# Altium schematic sheet EDP_Scematic.SchDoc
size A; SheetNumber: 1; SheetTotal: 1
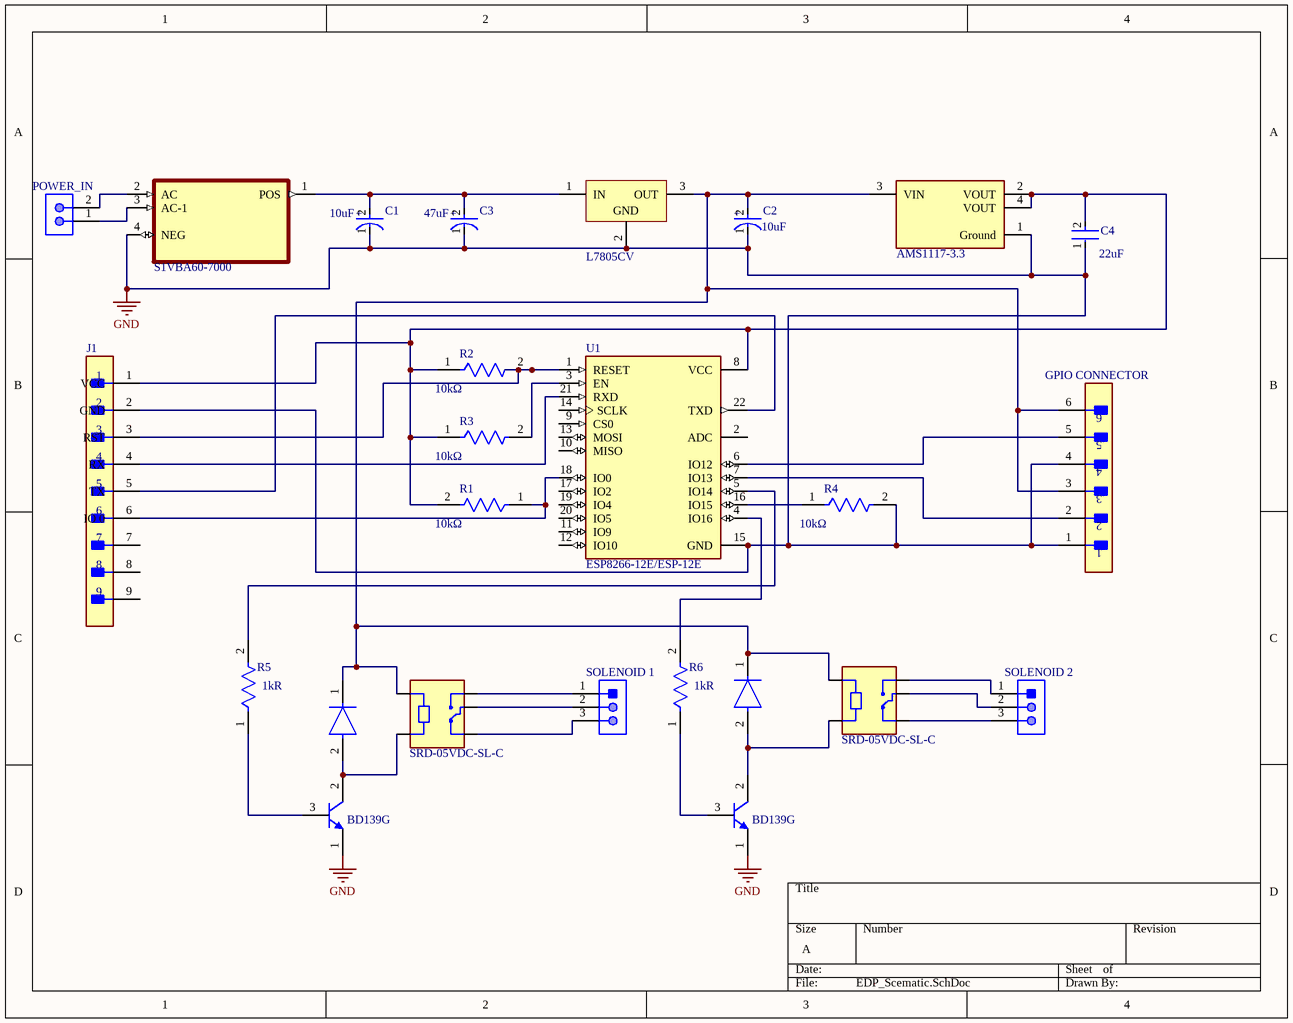
[diagram p0: EDP_Scematic.SchDoc]

## Parts
C1  Capacitance: 10uF  [FP-ECE-A1HN100U-MFG]  (hidden comment: ECE-A1HN100U)
C2  Capacitance: 10uF  [FP-ECE-A1HN100U-MFG]  (hidden comment: ECE-A1HN100U)
C3  Capacitance: 47uF  [FP-RAD-TH-D_6_3_0_5-L_11-MFG]  (hidden comment: EEUFR1H470)
C4  Capacitance: 22uF  [FP-RAD-TH-D_8_0_5-L_11_5-MFG]  (hidden comment: ECA1HEN220)
D1  1N4007-E3/54  [FP-1N4007-MFG]  (value not drawn)
D2  1N4007-E3/54  [FP-1N4007-MFG]  (value not drawn)
GPIO_CONNECTOR  22-27-2061  [FP-22-27-2061-MFG]  (value not drawn)
J1  GRPB091VWCN-RC  [FP-GRPB091VWCN-RC-MFG]  (value not drawn)
K1  SRD-05VDC-SL-C  [RELAY_SRD-05VDC-SL-C]
K2  SRD-05VDC-SL-C  [RELAY_SRD-05VDC-SL-C]
POWER_IN  22-27-2021  [MOLX-22-27-2021_V]  (value not drawn)
Q1  BD139G  [ONSC-TO-225-3-77-09]
Q2  BD139G  [ONSC-TO-225-3-77-09]
R1  Resistance: 10kΩ  [FP-CF18-MFG]  (hidden comment: CF18JT10K0)
R2  value 10kΩ  [FP-CF18-MFG]  (hidden comment: CF18JT10K0)
R3  value 10kΩ  [FP-CF18-MFG]  (hidden comment: CF18JT10K0)
R4  value 10kΩ  [FP-CF18-MFG]  (hidden comment: CF18JT10K0)
R5  Resistance: 1kR  [FP-MRS25-MFG]  (hidden comment: MRS25000C1001FCT00)
R6  Resistance: 1kR  [FP-MRS25-MFG]  (hidden comment: MRS25000C1001FCT00)
SOLENOID_1  22-27-2031  [MOLX-22-27-2031_V]  (value not drawn)
SOLENOID_2  22-27-2031  [MOLX-22-27-2031_V]  (value not drawn)
U1  ESP8266-12E/ESP-12E  [XCVR_ESP8266-12E/ESP-12E]
U2  L7805CV  [TO220]
U3  AMS1117-3.3  [FP-AMS1117-IPC_C]
U4  S1VBA60-7000  [DIOB_LL15XB60-7000]

## Nets
GND: C1.1(C) C2.1(C) C3.1(C) C4.1 GPIO_CONNECTOR.1 GPIO_CONNECTOR.4 J1.2(GND) Q1.1(E) Q2.1(E) R4.2 U1.15(GND) U2.2(GND) U3.1(Ground) U4.4(NEG)
NetC1_2: C1.2(A) C3.2(A) U2.1(IN) U4.1(POS)
NetC2_2: C2.2(A) D1.1(C) D2.1(C) GPIO_CONNECTOR.3 GPIO_CONNECTOR.6 K1.A1 K2.A1 U2.3(OUT) U3.3(VIN)
NetC4_2: C4.2 J1.1(VCC) R1.2 R2.1 R3.1 U1.8(VCC) U3.2(VOUT) U3.4(VOUT)
NetD1_2: D1.2(A) K2.A2 Q1.2(C)
NetD2_2: D2.2(A) K1.A2 Q2.2(C)
NetGPIO_CONNECTOR_2: GPIO_CONNECTOR.2 U1.7(IO13)
NetGPIO_CONNECTOR_5: GPIO_CONNECTOR.5 U1.6(IO12)
NetJ1_3: J1.3(RST) R2.2 U1.1(RESET)
NetJ1_4: J1.4(RX) U1.21(RXD)
NetJ1_5: J1.5(TX) U1.22(TXD)
NetJ1_6: J1.6(IO_0) R1.1 U1.18(IO0)
NetK1_COM: K1.COM SOLENOID_2.2
NetK1_NC: K1.NC SOLENOID_2.3
NetK1_NO: K1.NO SOLENOID_2.1
NetK2_COM: K2.COM SOLENOID_1.2
NetK2_NC: K2.NC SOLENOID_1.3
NetK2_NO: K2.NO SOLENOID_1.1
NetPOWER_IN_1: POWER_IN.1 U4.3(AC-1)
NetPOWER_IN_2: POWER_IN.2 U4.2(AC)
NetQ1_3: Q1.3(B) R5.1
NetQ2_3: Q2.3(B) R6.1
NetR3_2: R3.2 U1.3(EN)
NetR4_1: R4.1 U1.16(IO15)
NetR5_2: R5.2 U1.5(IO14)
NetR6_2: R6.2 U1.4(IO16)

Not connected (* = marked no-connect by the designer): J1 7 8 9; U1 2(ADC) 9(CS0) 10(MISO) 11(IO9) 12(IO10) 13(MOSI) 14(SCLK) 17(IO2) 19(IO4) 20(IO5)

## Notes on the sheet
- (in symbol CMP-05427-000036-1) +
- (in symbol CMP-05427-001321-1) +

## Library data of the parts
C1 C2 = CMP-05427-000036-1: CAP ALUM 10UF 20% 50V RADIAL; Leakage Current: 4.5uA; Lead Diameter: 0.5mm; Polarity: Bipolar; Life (Hours): 2000Hour; Dissipation Factor: 0.15%; Ripple Current (AC): 50mA; Dielectric Material: Aluminium; Construction: RADIAL; Contact Plating: Tin; Lead Free: Lead Free; Number of Pins: 2; Height: 11.2mm; Lead Pitch: 2.5mm; Length: 11.2mm; Radiation Hardening: No; Package Quantity: 200; Diameter: 6.3mm; Case/Package: Radial; Height - Seated (Max): 0.441inch; Voltage: 50V; Min Operating Temperature: -40°C; Tolerance: 20%; Voltage Rating (DC): 50V; Termination: Radial; Ripple Current: 50mA; Series: SU; REACH SVHC: No SVHC; Packaging: Bulk; Max Operating Temperature: 85°C; Voltage Rating: 50V; RoHS Compliant: Yes; Mount: Through Hole
C3 = CMP-05427-001321-1: Aluminum Electrolytic Capacitors (Radial Lead Type) 47uF ±20% 50V; Lead Diameter: 0.5mm; Ripple Current (AC): 405mA; Impedance: 140mR; Life (Hours): 5000Hour; Construction: RADIAL; REACH SVHC: Yes; Voltage: 50V; Packaging: Bulk; Series: FR Radial; Voltage Rating: 50V; Termination: Radial; Diameter: 6.3mm; Ripple Current: 405mA; Max Operating Temperature: 105°C; Height: 11.2mm; Lead Pitch: 2.5mm; Tolerance: 20%; Min Operating Temperature: -40°C; RoHS Compliant: Yes; Case/Package: Radial
C4 = CMP-05427-001829-1: Aluminum Electrolytic Capacitors (Radial Lead Type) 22uF ±20% 50V; Ripple Current: 90mA; Lead/Base Style: Straight; Max Operating Temperature: 105°C; Termination: Radial; Package Quantity: 200; Lead Pitch: 3.5mm; Mount: Through Hole; Min Operating Temperature: -40°C; Case/Package: Radial; Packaging: Bulk; Tolerance: 20%; Series: GA; Voltage Rating (DC): 50V
D1 D2 = CMP-02540-000046-1: DIODE GEN PURP 1KV 1A DO204AL; Manufacturer: Vishay; Value: 15pF; Max Junction Temp: +150°C; Max Surge Forward Current: 30A; Max Repetitive Reverse Voltage: 1000V; Peak Reverse Current: 30uA; Octopart: https://octopart.com/1n4007-e3%2F54-vishay-39548207; Digikey Description: DIODE GEN PURP 1KV 1A DO204AL; Category: Diode; Mouser Description: Rectifiers Vr/1000V Io/1A; Automotive: No; Package: 1N4007; Device Class L3: Rectifier Diodes; Temperature Range High: +150°C; Capacitance: 15pF; Ipc Land Pattern Name: DIOPA1088W105L520D270; Lead Free: Yes; ComponentLink2Description: Datasheet; Forward Current: 1A; Device Class L1: Discrete Semiconductors; ComponentLink2URL: http://www.vishay.com/docs/88503/1n4001.pdf; Temperature Range Low: -50°C; Height: 2.7mm; RoHS: TRUE; Temperature: -50°C to +150°C; Device Class L2: Diodes; Manufacturer Part Number: 1N4007-E3/54
GPIO_CONNECTOR = CMP-04776-000309-1: CONN HEADER VERT 6POS 2.54MM; Number of Contacts: 6; Current Rating: 4A; Voltage Rating (AC): 250V; Contact Resistance: 10mR; Hole Diameter: 1.02mm; Connector Type: Male Pin; Gender: Male; Mount: Through Hole; REACH SVHC: No SVHC; Number of Rows: 1; Contact Plating: Tin; Series: KK; Depth: 5.8mm; Flammability Rating: UL94 V-0; Contact Type: Male Pin; Lead Pitch: 2.54mm; Min Operating Temperature: 0°C; Pitch: 2.54mm; Radiation Hardening: No; Color: Natural; Length: 15.24mm; Termination: Solder; Orientation: Straight; Contact Material: Brass; Max Voltage Rating (AC): 250V; Housing Material: Nylon; Max Operating Temperature: 75°C; Working Voltage: 250V; Max Current Rating: 4A; Fastening Type: Friction; Voltage Rating: 250V; Housing Color: White; Packaging: Bulk; Material: Nylon; Contact Mating Length: 0.295inch; Package Quantity: 10000; Number of Positions: 6
J1 = CMP-25680-000033-1: CONN HEADER R/A 9POS 1.27MM; Pitch: 0.05inch; Number of Positions: 9; Connector Type: Male Pin; Contact Plating: Gold; Lead Free: Lead Free; Mount: Through Hole; Contact Mating Length: 0.118inch; Package Quantity: 1; Contact Type: Male Pin; Packaging: Bulk; Number of Rows: 1; Termination: Solder
K1 K2 = SRD-05VDC-SL-C: 5V Trigger Relay Module For Arduino And Raspberry Pi 5V Trigger Relay Module For Arduino And Raspberry Pi; MF: Songle Relay; Check_prices: https://www.snapeda.com/parts/SRD-05VDC-SL-C/Songle+Relay/view-part/?ref=eda; Value: *; Availability: Not in stock; Price: None; Package: NON STANDARD-5 Songle Relay; MP: SRD-05VDC-SL-C; SnapEDA_Link: https://www.snapeda.com/parts/SRD-05VDC-SL-C/Songle+Relay/view-part/?ref=snap
POWER_IN = CMP-2000-05537-1: Male Header, Pitch 2.54 mm, 1 x 2 Position, Height 11.7 mm, Tail Length 3.56 mm, 0 to 75 degC, RoHS, Bulk; Manufacturer: Molex; PartNumber: 0022272021; Current rating: 4A; Package Version: Rev. BC, 02/2012; Voltage rating: 250V; No. of Positions: 2; Pitch: 2.54mm; No. of Rows: 1; Orientation: Vertical; Operating temperature: 0°Cto+75°C; Manufacturer URL: http://www.molex.com/; Mounting Technology: ThroughHole; Housing material: Nylon(UL94V-0); Package Description: 2-Leads Header, Body 5.08 x 5.8 mm, Pitch 2.54 mm; Voltage - Max: 250V; Datasheet URL: http://www.molex.com/pdm_docs/sd/022272021_sd.pdf; Package Reference: 22-27-2021; Contact material: Tinplatedbrass; Current - Max: 4A; Datasheet Version: Rev. F, 06/2009
Q1 Q2 = CMP-1048-01269-1: Plastic Medium-Power Silicon NPN Transistor, 3-Pin TO-225, Pb-Free, Bulk Box; Manufacturer: On Semiconductor; IC Continuous (A): 1.5; ComponentLink2URL: http://www.onsemi.com/pub_link/Collateral/BD135-D.PDF; Polarity: NPN; DatasheetVersion: Rev. 16; RoHS: TRUE; PackageReference: TO-225-3-77-09; Packing: Bulk Box; ComponentLink1URL: http://www.onsemi.com/; PackageVersion: Rev. AC, 12/2013; ComponentLink3URL: http://www.onsemi.com/pub_link/Collateral/77-09.PDF; ComponentLink3Description: Package Specification; Mounting Technology: Through Hole; PackageDescription: 3-Pin Flange Mount, Vertical Straight Lead, Body 7.6 x 2.7 mm, Pitch 2.29 mm; ComponentLink1Description: Manufacturer URL; ComponentLink2Description: Datasheet; PartNumber: BD139G
R1 = CMP-26528-000002-1: RES 10K OHM 1/8W 5% CF AXIAL; Manufacturer: Stackpole Electronics; Power Rating: 0.125W; Temperature Coefficient: 0-500ppm/°C; Voltage Rating: 250V; Value: 10kΩ; Temperature: -55°C to +155°C; Height: 2mm; Lead Free: Yes; Automotive: No; Device Class L2: Resistors; Package: CF18; Series: CF; ComponentLink2Description: Datasheet; Ipc Land Pattern Name: RESAD656W65L360D200; Manufacturer Part Number: CF18JT10K0; Temperature Range High: +155°C; RoHS: TRUE; Device Class L3: Through-Hole Resistors; Temperature Range Low: -55°C; Device Class L1: Passive Components; Category: Res; Octopart: https://octopart.com/cf18jt10k0-stackpole+electronics-19205642; Composition: Carbon Film; Digikey Description: RES 10K OHM 1/8W 5% CF AXIAL; ComponentLink2URL: http://www.seielect.com/Catalog/SEI-CF_CFM.pdf; Tolerance: 5%
R2-R4 = CMP-26528-000002-1: RES 10K OHM 1/8W 5% CF AXIAL; Manufacturer: Stackpole Electronics; Power Rating: 0.125W; Temperature Coefficient: 0-500ppm/°C; Voltage Rating: 250V; Temperature: -55°C to +155°C; Height: 2mm; Lead Free: Yes; Automotive: No; Device Class L2: Resistors; Package: CF18; Series: CF; ComponentLink2Description: Datasheet; Ipc Land Pattern Name: RESAD656W65L360D200; Manufacturer Part Number: CF18JT10K0; Temperature Range High: +155°C; Resistance: 10kΩ; RoHS: TRUE; Device Class L3: Through-Hole Resistors; Temperature Range Low: -55°C; Device Class L1: Passive Components; Category: Res; Octopart: https://octopart.com/cf18jt10k0-stackpole+electronics-19205642; Composition: Carbon Film; Digikey Description: RES 10K OHM 1/8W 5% CF AXIAL; ComponentLink2URL: http://www.seielect.com/Catalog/SEI-CF_CFM.pdf; Tolerance: 5%
R5 R6 = CMP-02408-000051-1: RES 1K OHM 0.6W 1% AXIAL; Power Rating: 600mW; Lead Diameter: 0.6mm; Voltage Rating (DC): 350V; Temperature Coefficient: 50ppm/°C; Width: 2.5mm; Military Standard: Not; Package Quantity: 5000; Radiation Hardening: No; Case/Package: Axial; Resistance Tolerance: 1%; Resistor Type: Metal Film; Contact Plating: Tin; Length: 6.5mm; Lead Free: Lead Free; RoHS Compliant: Yes; Mount: Through Hole; Number of Pins: 2; Technology: THIN FILM; Voltage Rating: 350V; Min Operating Temperature: -55°C; Weight: 0.00776oz; Diameter: 2.5mm; Construction: Cylindrical; Series: MRS25; Tolerance: 1%; Packaging: Tape and Reel; Max Operating Temperature: 155°C; Max Power Dissipation: 600mW; Number of Terminations: 2; Termination: Axial
SOLENOID_1 SOLENOID_2 = CMP-2000-05538-1: Male Header, Pitch 2.54 mm, 1 x 3 Position, Height 11.7 mm, Tail Length 3.56 mm, -40 to 80 degC, RoHS, Bulk; Manufacturer: Molex; Voltage rating: 250V; Current rating: 4A; Package Reference: 22-27-2031; Housing material: Nylon(UL94V-0); Operating temperature: 0°Cto+75°C; Package Description: Male Header, Pitch 2.54 mm, 1 x 3 Position, Height 11.7 mm, Tail Length 3.56 mm; Package URL: http://www.molex.com/pdm_docs/sd/022272031_sd.pdf; Datasheet Version: 06/2016; Manufacturer URL: http://www.molex.com/; Mounting Technology: ThroughHole; Datasheet URL: http://www.molex.com/webdocs/datasheets/pdf/en-us/0022272031_PCB_HEADERS.pdf; Contact material: Tinplatedbrass
U1 = ESP8266-12E/ESP-12E: This WiFi module has a 32-bit MCU micro and clock speeds supporting 80 MHz or 160 MHz. Supports the RTOS and integrated Wi-Fi MAC/BB/RF/PA/LNA, and has an on-board antenna.; MF: AI-Thinker; Value: *; SnapEDA_Link: https://www.snapeda.com/parts/ESP8266-12E/ESP-12E/AI-Thinker/view-part/?ref=snap; Availability: Not in stock; Price: None; Package: None; Check_prices: https://www.snapeda.com/parts/ESP8266-12E/ESP-12E/AI-Thinker/view-part/?ref=eda; MP: ESP8266-12E/ESP-12E
U2 = CMP-0244-00483-1: Positive Voltage Regulator, 5V, 3-Pin TO-220; PackageDescription: TO, Thru-Hole, Vertical, Heatsink Mounted; 3 In-Line Leads; Pitch 2.54 mm; ComponentLink2Description: Datasheet; PackageReference: TO220; ComponentLink3URL: http://www.st.com/internet/com/TECHNICAL_RESOURCES/TECHNICAL_LITERATURE/PACKAGE_INFORMATION/CD00004649.pdf; DatasheetVersion: 16/11/2011; ComponentLink1Description: Manufacturer URL; ComponentLink1URL: http://www.st.com; PackageVersion: ver3.0; ComponentLink3Description: Package Specification; ComponentLink2URL: http://www.st.com/internet/com/TECHNICAL_RESOURCES/TECHNICAL_LITERATURE/DATASHEET/CD00000444.pdf
U3 = CMP-209535-000001-1: LDO Voltage Regulators 1A, 3.3V; Manufacturer: Advanced Monolithic Systems; Dropout Voltage: 1.1V; Output Type: Fixed; Nominal Supply Current: 5mA; Max Power Dissipation: 1.2W; Max Supply Voltage: 15V; Number Of Outputs: 1; Standoff Height: 0.64mm; Max Junction Temp: +125°C; Height: 1.8mm; Package: AMS1117; Device Class L2: Power Management ICs; ComponentLink2Description: Datasheet; ComponentLink2URL: http://www.advanced-monolithic.com/pdf/ds1117.pdf; Category: IC; RoHS: TRUE; Automotive: No; Device Class L1: Integrated Circuits (ICs); Output Current: 1A; Device Class L3: Voltage Regulators - Linear; Temperature: -40°C to +125°C; Output Voltage: 3.3V; Manufacturer Part Number: AMS1117-3.3; Temperature Range Low: -40°C; Octopart: https://octopart.com/ams1117-3.3-advanced+monolithic+systems-25899300; Lead Free: Yes; Ipc Land Pattern Name: SOT229P700X180-4; Temperature Range High: +125°C
U4 = S1VBA60-7000: 1 IO, 600 VRM, 700 VRSM, THD Bridge Diode, 1V Package Type; MF: Shindengen; Package: SIP-4 Shindengen; Price: None; Value: *; SnapEDA_Link: https://www.snapeda.com/parts/S1VBA60-7000/Shindengen/view-part/?ref=snap; MP: S1VBA60-7000; Availability: In Stock; Check_prices: https://www.snapeda.com/parts/S1VBA60-7000/Shindengen/view-part/?ref=eda